# Altium schematic sheet Sensors.SchDoc
size A4; SheetNumber: 4; SheetTotal: 8
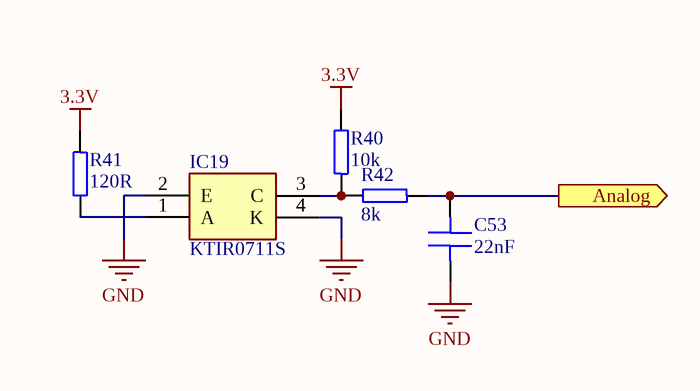
[diagram p0: Sensors.SchDoc]

## Parts
C53  22nF  [C 0402]
IC19  KTIR0711S  [KTIR0711S]
R40  10k  [R 0402]
R41  120R  [R 0402]
R42  8k  [R 0402]

## Ports
Analog (out)

## Nets
3.3V: R40.2 R41.1
GND: C53.2 IC19.2(E) IC19.4(K)
Analog: C53.1 R42.1 ; port Analog
NetIC19_1: IC19.1(A) R41.2
NetIC19_3: IC19.3(C) R40.1 R42.2

## Library data of the parts
C53 = Capacitor: MLCC Capacitor
IC19 = KTIR0711S: Integrated Circuit; Manufacturer_Name: Kingbright; Datasheet Link: https://componentsearchengine.com/Datasheets/2/KTIR0711S.pdf; Height: 1.75mm; Manufacturer_Part_Number: KTIR0711S; Mouser Part Number: N/A; Mouser Price/Stock: https://www.mouser.co.uk/ProductDetail/Kingbright/KTIR0711S?qs=2JU0tDl2GZ3YXiPz2j0FpQ%3D%3D
R40-R42 = Resistor: General pourpouse resistor